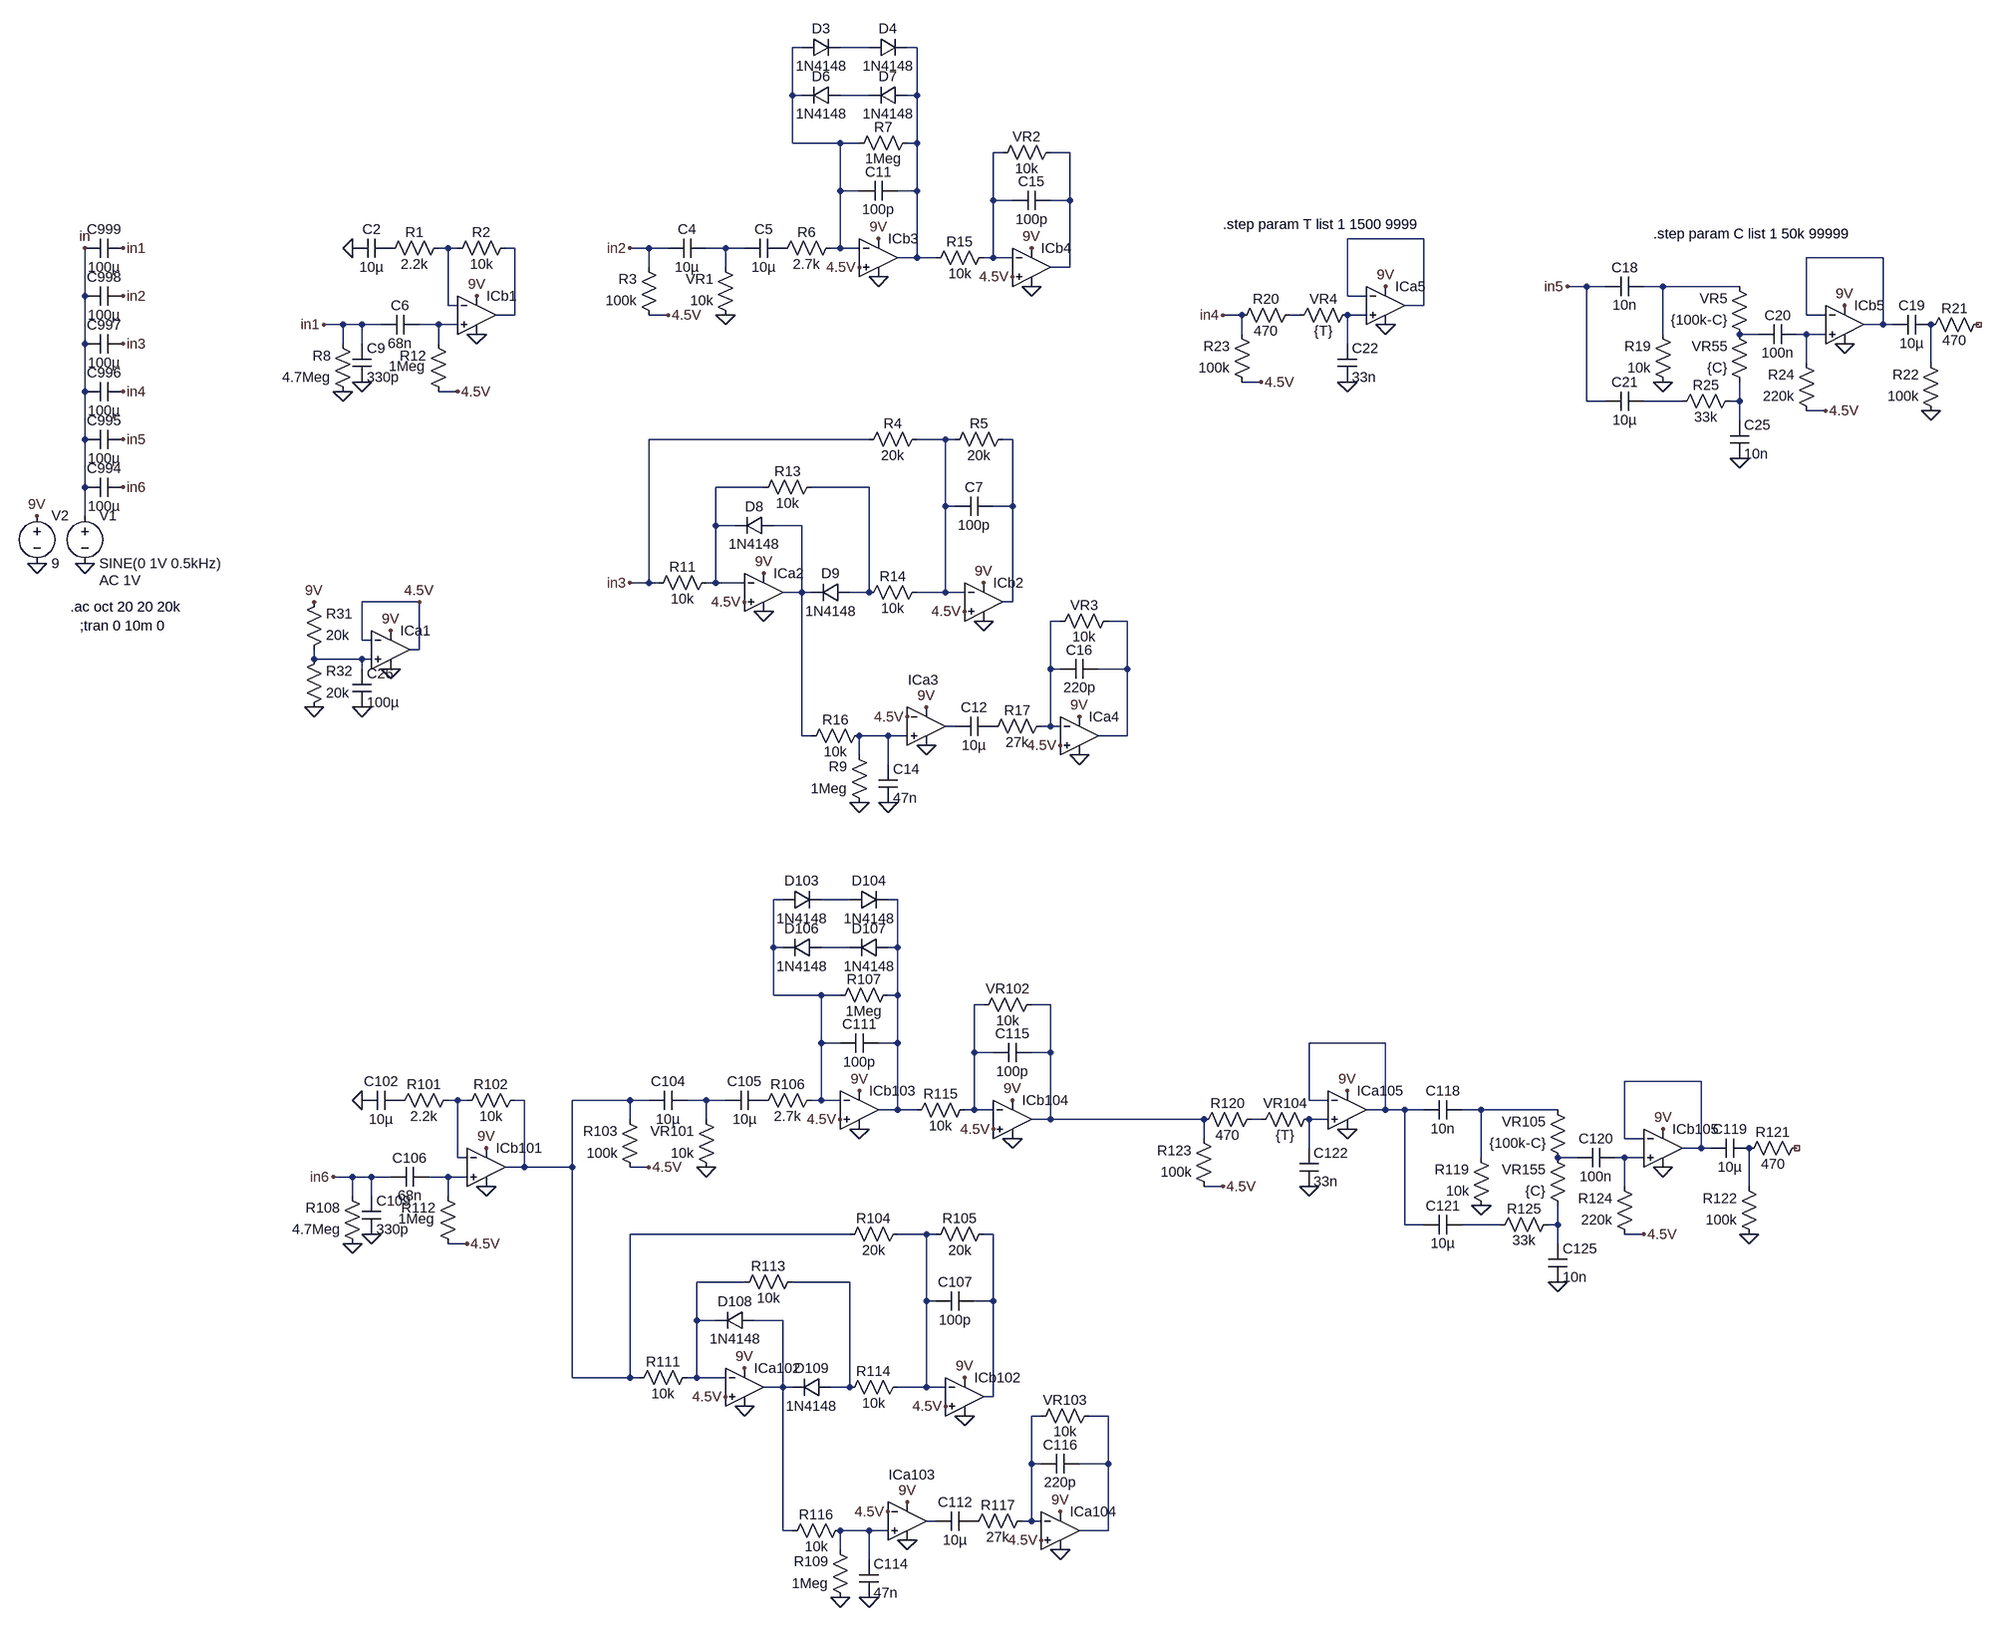
[diagram p0: schematic TheTrapperDualFuzz.asc]
TheTrapperDualFuzz.asc, the LTspice schematic file:
Version 4
SHEET 1 3148 3460
WIRE -768 400 -784 400
WIRE -656 400 -704 400
WIRE -576 400 -592 400
WIRE -784 480 -784 400
WIRE -768 480 -784 480
WIRE -656 480 -704 480
WIRE -576 480 -576 400
WIRE -576 480 -592 480
WIRE -784 560 -784 480
WIRE -704 560 -784 560
WIRE -672 560 -704 560
WIRE -576 560 -576 480
WIRE -576 560 -592 560
WIRE -432 576 -448 576
WIRE -320 576 -352 576
WIRE -704 640 -704 560
WIRE -672 640 -704 640
WIRE -576 640 -576 560
WIRE -576 640 -608 640
WIRE -448 656 -448 576
WIRE -416 656 -448 656
WIRE -320 656 -320 576
WIRE -320 656 -352 656
WIRE 272 720 144 720
WIRE -1360 736 -1376 736
WIRE -1344 736 -1360 736
WIRE -1248 736 -1264 736
WIRE -1024 736 -1056 736
WIRE -992 736 -1024 736
WIRE -896 736 -928 736
WIRE -864 736 -896 736
WIRE -704 736 -704 640
WIRE -704 736 -720 736
WIRE -672 736 -704 736
WIRE -576 752 -576 640
WIRE -576 752 -608 752
WIRE -544 752 -576 752
WIRE -448 752 -448 656
WIRE -448 752 -464 752
WIRE -416 752 -448 752
WIRE 1040 752 912 752
WIRE -1024 768 -1024 736
WIRE -896 768 -896 736
WIRE -320 768 -320 656
WIRE -320 768 -352 768
WIRE 544 800 512 800
WIRE 576 800 544 800
WIRE 672 800 640 800
WIRE 800 800 672 800
WIRE -1984 816 -1984 736
WIRE 144 816 144 720
WIRE 176 816 144 816
WIRE -1360 832 -1360 736
WIRE -1344 832 -1360 832
WIRE 272 832 272 720
WIRE 272 832 240 832
WIRE -1248 848 -1248 736
WIRE -1248 848 -1280 848
WIRE -992 848 -1024 848
WIRE -32 848 -64 848
WIRE 64 848 48 848
WIRE 176 848 144 848
WIRE 912 848 912 752
WIRE 944 848 912 848
WIRE -1536 864 -1568 864
WIRE -1504 864 -1536 864
WIRE -1472 864 -1504 864
WIRE -1376 864 -1408 864
WIRE -1344 864 -1376 864
WIRE 1040 864 1040 752
WIRE 1040 864 1008 864
WIRE 1056 864 1040 864
WIRE -32 880 -32 848
WIRE 672 880 672 800
WIRE 832 880 800 880
WIRE 912 880 896 880
WIRE 944 880 912 880
WIRE -1984 896 -1984 816
WIRE -1536 896 -1536 864
WIRE -1504 896 -1504 864
WIRE -1376 896 -1376 864
WIRE 144 896 144 848
WIRE 912 928 912 880
WIRE 1120 928 1120 864
WIRE 0 960 -32 960
WIRE -1984 976 -1984 896
WIRE -1344 976 -1376 976
WIRE 544 992 544 800
WIRE 576 992 544 992
WIRE 704 992 640 992
WIRE 800 992 800 960
WIRE 800 992 784 992
WIRE 944 1008 912 1008
WIRE 800 1024 800 992
WIRE -1984 1056 -1984 976
WIRE -656 1056 -1024 1056
WIRE -528 1056 -576 1056
WIRE -512 1056 -528 1056
WIRE -416 1056 -432 1056
WIRE -1984 1136 -1984 1056
WIRE -832 1136 -912 1136
WIRE -656 1136 -752 1136
WIRE -528 1168 -528 1056
WIRE -512 1168 -528 1168
WIRE -416 1168 -416 1056
WIRE -416 1168 -448 1168
WIRE -1984 1184 -1984 1136
WIRE -912 1200 -912 1136
WIRE -880 1200 -912 1200
WIRE -768 1200 -816 1200
WIRE -1024 1296 -1024 1056
WIRE -1024 1296 -1056 1296
WIRE -1008 1296 -1024 1296
WIRE -912 1296 -912 1200
WIRE -912 1296 -928 1296
WIRE -864 1296 -912 1296
WIRE -768 1312 -768 1200
WIRE -768 1312 -800 1312
WIRE -752 1312 -768 1312
WIRE -656 1312 -656 1136
WIRE -656 1312 -688 1312
WIRE -528 1312 -528 1168
WIRE -528 1312 -576 1312
WIRE -496 1312 -528 1312
WIRE -1408 1328 -1504 1328
WIRE -416 1328 -416 1168
WIRE -416 1328 -432 1328
WIRE -336 1360 -352 1360
WIRE -224 1360 -256 1360
WIRE -1504 1392 -1504 1328
WIRE -1488 1392 -1504 1392
WIRE -1408 1408 -1408 1328
WIRE -1408 1408 -1424 1408
WIRE -1584 1424 -1584 1408
WIRE -1504 1424 -1584 1424
WIRE -1488 1424 -1504 1424
WIRE -1504 1440 -1504 1424
WIRE -352 1440 -352 1360
WIRE -336 1440 -352 1440
WIRE -224 1440 -224 1360
WIRE -224 1440 -272 1440
WIRE -512 1536 -528 1536
WIRE -352 1536 -352 1440
WIRE -352 1536 -368 1536
WIRE -336 1536 -352 1536
WIRE -768 1552 -768 1312
WIRE -752 1552 -768 1552
WIRE -624 1552 -672 1552
WIRE -592 1552 -624 1552
WIRE -224 1552 -224 1440
WIRE -224 1552 -272 1552
WIRE -672 1584 -672 1552
WIRE -624 1600 -624 1552
WIRE -800 1936 -816 1936
WIRE -688 1936 -736 1936
WIRE -608 1936 -624 1936
WIRE -816 2016 -816 1936
WIRE -800 2016 -816 2016
WIRE -688 2016 -736 2016
WIRE -608 2016 -608 1936
WIRE -608 2016 -624 2016
WIRE -816 2096 -816 2016
WIRE -736 2096 -816 2096
WIRE -704 2096 -736 2096
WIRE -608 2096 -608 2016
WIRE -608 2096 -624 2096
WIRE -464 2112 -480 2112
WIRE -352 2112 -384 2112
WIRE -736 2176 -736 2096
WIRE -704 2176 -736 2176
WIRE -608 2176 -608 2096
WIRE -608 2176 -640 2176
WIRE 208 2176 80 2176
WIRE -480 2192 -480 2112
WIRE -448 2192 -480 2192
WIRE -352 2192 -352 2112
WIRE -352 2192 -384 2192
WIRE 736 2240 608 2240
WIRE -1344 2272 -1360 2272
WIRE -1328 2272 -1344 2272
WIRE -1232 2272 -1248 2272
WIRE -1056 2272 -1152 2272
WIRE -1024 2272 -1056 2272
WIRE -928 2272 -960 2272
WIRE -896 2272 -928 2272
WIRE -736 2272 -736 2176
WIRE -736 2272 -752 2272
WIRE -704 2272 -736 2272
WIRE 80 2272 80 2176
WIRE 112 2272 80 2272
WIRE -608 2288 -608 2176
WIRE -608 2288 -640 2288
WIRE -576 2288 -608 2288
WIRE -480 2288 -480 2192
WIRE -480 2288 -496 2288
WIRE -448 2288 -480 2288
WIRE 208 2288 208 2176
WIRE 208 2288 176 2288
WIRE 240 2288 208 2288
WIRE 272 2288 240 2288
WIRE 368 2288 336 2288
WIRE 496 2288 368 2288
WIRE -1056 2304 -1056 2272
WIRE -928 2304 -928 2272
WIRE -352 2304 -352 2192
WIRE -352 2304 -384 2304
WIRE -96 2304 -352 2304
WIRE 0 2304 -16 2304
WIRE 112 2304 80 2304
WIRE -96 2336 -96 2304
WIRE 608 2336 608 2240
WIRE 640 2336 608 2336
WIRE 80 2352 80 2304
WIRE 736 2352 736 2240
WIRE 736 2352 704 2352
WIRE 752 2352 736 2352
WIRE -1344 2368 -1344 2272
WIRE -1328 2368 -1344 2368
WIRE 368 2368 368 2288
WIRE 528 2368 496 2368
WIRE 608 2368 592 2368
WIRE 640 2368 608 2368
WIRE -1232 2384 -1232 2272
WIRE -1232 2384 -1264 2384
WIRE -1152 2384 -1152 2272
WIRE -1152 2384 -1232 2384
WIRE -1024 2384 -1056 2384
WIRE -1520 2400 -1552 2400
WIRE -1488 2400 -1520 2400
WIRE -1456 2400 -1488 2400
WIRE -1360 2400 -1392 2400
WIRE -1328 2400 -1360 2400
WIRE -64 2416 -96 2416
WIRE 608 2416 608 2368
WIRE 816 2416 816 2352
WIRE -1520 2432 -1520 2400
WIRE -1488 2432 -1488 2400
WIRE -1360 2432 -1360 2400
WIRE 240 2480 240 2288
WIRE 272 2480 240 2480
WIRE 400 2480 336 2480
WIRE 496 2480 496 2448
WIRE 496 2480 480 2480
WIRE -688 2496 -1056 2496
WIRE -560 2496 -608 2496
WIRE -544 2496 -560 2496
WIRE -448 2496 -464 2496
WIRE 640 2496 608 2496
WIRE -1328 2512 -1360 2512
WIRE 496 2512 496 2480
WIRE -864 2576 -944 2576
WIRE -688 2576 -784 2576
WIRE -560 2608 -560 2496
WIRE -544 2608 -560 2608
WIRE -448 2608 -448 2496
WIRE -448 2608 -480 2608
WIRE -944 2640 -944 2576
WIRE -912 2640 -944 2640
WIRE -800 2640 -848 2640
WIRE -1152 2736 -1152 2384
WIRE -1056 2736 -1056 2496
WIRE -1056 2736 -1152 2736
WIRE -1040 2736 -1056 2736
WIRE -944 2736 -944 2640
WIRE -944 2736 -960 2736
WIRE -896 2736 -944 2736
WIRE -800 2752 -800 2640
WIRE -800 2752 -832 2752
WIRE -784 2752 -800 2752
WIRE -688 2752 -688 2576
WIRE -688 2752 -720 2752
WIRE -560 2752 -560 2608
WIRE -560 2752 -608 2752
WIRE -528 2752 -560 2752
WIRE -448 2768 -448 2608
WIRE -448 2768 -464 2768
WIRE -368 2800 -384 2800
WIRE -256 2800 -288 2800
WIRE -384 2880 -384 2800
WIRE -368 2880 -384 2880
WIRE -256 2880 -256 2800
WIRE -256 2880 -304 2880
WIRE -544 2976 -560 2976
WIRE -384 2976 -384 2880
WIRE -384 2976 -400 2976
WIRE -368 2976 -384 2976
WIRE -800 2992 -800 2752
WIRE -784 2992 -800 2992
WIRE -656 2992 -704 2992
WIRE -624 2992 -656 2992
WIRE -256 2992 -256 2880
WIRE -256 2992 -304 2992
WIRE -704 3024 -704 2992
WIRE -656 3040 -656 2992
FLAG -1984 1264 0
FLAG -1984 736 in
FLAG -1584 1504 0
FLAG -1504 1504 0
FLAG -2064 1264 0
FLAG -2064 1184 9V
FLAG -1584 1328 9V
FLAG -832 1344 0
FLAG -832 1280 9V
FLAG -464 1360 0
FLAG -464 1296 9V
FLAG -1456 1376 9V
FLAG -1456 1440 0
FLAG -1408 1328 4.5V
FLAG -864 1328 4.5V
FLAG -496 1344 4.5V
FLAG -560 1504 9V
FLAG -560 1568 0
FLAG -592 1520 4.5V
FLAG -672 1664 0
FLAG -624 1664 0
FLAG -304 1520 9V
FLAG -304 1584 0
FLAG -336 1568 4.5V
FLAG -1536 976 0
FLAG -1504 960 0
FLAG -1312 816 9V
FLAG -1312 880 0
FLAG -1520 736 0
FLAG -1344 976 4.5V
FLAG -992 848 4.5V
FLAG -896 848 0
FLAG -640 720 9V
FLAG -640 784 0
FLAG -672 768 4.5V
FLAG -384 736 9V
FLAG -384 800 0
FLAG -416 784 4.5V
FLAG 0 960 4.5V
FLAG 208 800 9V
FLAG 208 864 0
FLAG 144 960 0
FLAG 800 1088 0
FLAG 672 960 0
FLAG 976 832 9V
FLAG 976 896 0
FLAG 944 1008 4.5V
FLAG 1120 1008 0
FLAG -1920 736 in1
FLAG -1920 816 in2
FLAG -1920 896 in3
FLAG -1920 976 in4
FLAG -1920 1056 in5
FLAG -1920 1136 in6
FLAG -1568 864 in1
FLAG -1056 736 in2
FLAG -1056 1296 in3
FLAG -64 848 in4
FLAG 512 800 in5
FLAG -864 2784 0
FLAG -864 2720 9V
FLAG -496 2800 0
FLAG -496 2736 9V
FLAG -896 2768 4.5V
FLAG -528 2784 4.5V
FLAG -592 2944 9V
FLAG -592 3008 0
FLAG -624 2960 4.5V
FLAG -704 3104 0
FLAG -656 3104 0
FLAG -336 2960 9V
FLAG -336 3024 0
FLAG -368 3008 4.5V
FLAG -1520 2512 0
FLAG -1488 2496 0
FLAG -1296 2352 9V
FLAG -1296 2416 0
FLAG -1504 2272 0
FLAG -1328 2512 4.5V
FLAG -1024 2384 4.5V
FLAG -928 2384 0
FLAG -672 2256 9V
FLAG -672 2320 0
FLAG -704 2304 4.5V
FLAG -416 2272 9V
FLAG -416 2336 0
FLAG -448 2320 4.5V
FLAG -64 2416 4.5V
FLAG 144 2256 9V
FLAG 144 2320 0
FLAG 80 2416 0
FLAG 496 2576 0
FLAG 368 2448 0
FLAG 672 2320 9V
FLAG 672 2384 0
FLAG 640 2496 4.5V
FLAG 816 2496 0
FLAG -1552 2400 in6
SYMBOL voltage -1984 1168 R0
WINDOW 123 24 124 Left 2
WINDOW 39 0 0 Left 2
SYMATTR Value2 AC 1V
SYMATTR InstName V1
SYMATTR Value SINE(0 1V 0.5kHz)
SYMBOL res -1600 1424 M180
WINDOW 0 36 76 Left 2
WINDOW 3 36 40 Left 2
SYMATTR InstName R31
SYMATTR Value 20k
SYMBOL res -1600 1520 M180
WINDOW 0 36 76 Left 2
WINDOW 3 36 40 Left 2
SYMATTR InstName R32
SYMATTR Value 20k
SYMBOL cap -1520 1504 M180
WINDOW 0 24 56 Left 2
WINDOW 3 24 8 Left 2
SYMATTR InstName C26
SYMATTR Value 100µ
SYMBOL voltage -2064 1168 R0
WINDOW 123 0 0 Left 0
WINDOW 39 0 0 Left 0
SYMATTR InstName V2
SYMATTR Value 9
SYMBOL res -736 1120 R90
WINDOW 0 5 56 VBottom 2
WINDOW 3 27 56 VTop 2
SYMATTR InstName R13
SYMATTR Value 10k
SYMBOL diode -688 1296 R90
WINDOW 0 0 32 VBottom 2
WINDOW 3 32 32 VTop 2
SYMATTR InstName D9
SYMATTR Value 1N4148
SYMBOL diode -816 1216 M270
WINDOW 0 32 32 VTop 2
WINDOW 3 0 32 VBottom 2
SYMATTR InstName D8
SYMATTR Value 1N4148
SYMBOL res -912 1280 R90
WINDOW 0 5 56 VBottom 2
WINDOW 3 27 56 VTop 2
SYMATTR InstName R11
SYMATTR Value 10k
SYMBOL res -560 1296 R90
WINDOW 0 5 56 VBottom 2
WINDOW 3 27 56 VTop 2
SYMATTR InstName R14
SYMATTR Value 10k
SYMBOL res -560 1040 R90
WINDOW 0 5 56 VBottom 2
WINDOW 3 27 56 VTop 2
SYMATTR InstName R4
SYMATTR Value 20k
SYMBOL res -416 1040 R90
WINDOW 0 5 56 VBottom 2
WINDOW 3 27 56 VTop 2
SYMATTR InstName R5
SYMATTR Value 20k
SYMBOL Opamps\\UniversalOpamp2 -1456 1408 R0
SYMATTR InstName ICa1
SYMBOL cap -448 1152 R90
WINDOW 0 0 32 VBottom 2
WINDOW 3 32 32 VTop 2
SYMATTR InstName C7
SYMATTR Value 100p
SYMBOL Opamps\\UniversalOpamp2 -832 1312 R0
SYMATTR InstName ICa2
SYMBOL Opamps\\UniversalOpamp2 -464 1328 R0
SYMATTR InstName ICb2
SYMBOL res -656 1536 R90
WINDOW 0 5 56 VBottom 2
WINDOW 3 27 56 VTop 2
SYMATTR InstName R16
SYMATTR Value 10k
SYMBOL res -656 1680 R180
WINDOW 0 36 76 Left 2
WINDOW 3 36 40 Left 2
SYMATTR InstName R9
SYMATTR Value 1Meg
SYMBOL cap -640 1600 R0
SYMATTR InstName C14
SYMATTR Value 47n
SYMBOL Opamps\\UniversalOpamp2 -560 1536 R0
WINDOW 0 -31 -77 Left 2
SYMATTR InstName ICa3
SYMBOL cap -448 1520 R90
WINDOW 0 0 32 VBottom 2
WINDOW 3 32 32 VTop 2
SYMATTR InstName C12
SYMATTR Value 10µ
SYMBOL Opamps\\UniversalOpamp2 -304 1552 R0
SYMATTR InstName ICa4
SYMBOL res -352 1520 R90
WINDOW 0 5 56 VBottom 2
WINDOW 3 27 56 VTop 2
SYMATTR InstName R17
SYMATTR Value 27k
SYMBOL res -240 1344 R90
WINDOW 0 5 56 VBottom 2
WINDOW 3 27 56 VTop 2
SYMATTR InstName VR3
SYMATTR Value 10k
SYMBOL cap -272 1424 R90
WINDOW 0 0 32 VBottom 2
WINDOW 3 32 32 VTop 2
SYMATTR InstName C16
SYMATTR Value 220p
SYMBOL res -1520 992 R180
WINDOW 0 36 76 Left 2
WINDOW 3 36 40 Left 2
SYMATTR InstName R8
SYMATTR Value 4.7Meg
SYMBOL cap -1520 896 R0
SYMATTR InstName C9
SYMATTR Value 330p
SYMBOL cap -1408 848 R90
WINDOW 0 0 32 VBottom 2
WINDOW 3 32 32 VTop 2
SYMATTR InstName C6
SYMATTR Value 68n
SYMBOL res -1360 992 R180
WINDOW 0 36 76 Left 2
WINDOW 3 38 58 Left 2
SYMATTR InstName R12
SYMATTR Value 1Meg
SYMBOL Opamps\\UniversalOpamp2 -1312 848 R0
SYMATTR InstName ICb1
SYMBOL res -1248 720 R90
WINDOW 0 5 56 VBottom 2
WINDOW 3 27 56 VTop 2
SYMATTR InstName R2
SYMATTR Value 10k
SYMBOL res -1360 720 R90
WINDOW 0 5 56 VBottom 2
WINDOW 3 27 56 VTop 2
SYMATTR InstName R1
SYMATTR Value 2.2k
SYMBOL cap -1456 720 R90
WINDOW 0 0 32 VBottom 2
WINDOW 3 32 32 VTop 2
SYMATTR InstName C2
SYMATTR Value 10µ
SYMBOL res -1008 864 R180
WINDOW 0 36 76 Left 2
WINDOW 3 36 40 Left 2
SYMATTR InstName R3
SYMATTR Value 100k
SYMBOL cap -928 720 R90
WINDOW 0 0 32 VBottom 2
WINDOW 3 32 32 VTop 2
SYMATTR InstName C4
SYMATTR Value 10µ
SYMBOL res -880 864 R180
WINDOW 0 36 76 Left 2
WINDOW 3 36 40 Left 2
SYMATTR InstName VR1
SYMATTR Value 10k
SYMBOL cap -800 720 R90
WINDOW 0 0 32 VBottom 2
WINDOW 3 32 32 VTop 2
SYMATTR InstName C5
SYMATTR Value 10µ
SYMBOL res -704 720 R90
WINDOW 0 5 56 VBottom 2
WINDOW 3 27 56 VTop 2
SYMATTR InstName R6
SYMATTR Value 2.7k
SYMBOL Opamps\\UniversalOpamp2 -640 752 R0
SYMATTR InstName ICb3
SYMBOL cap -608 624 R90
WINDOW 0 0 32 VBottom 2
WINDOW 3 32 32 VTop 2
SYMATTR InstName C11
SYMATTR Value 100p
SYMBOL res -576 544 R90
WINDOW 0 5 56 VBottom 2
WINDOW 3 27 56 VTop 2
SYMATTR InstName R7
SYMATTR Value 1Meg
SYMBOL diode -704 496 M270
WINDOW 0 32 32 VTop 2
WINDOW 3 0 32 VBottom 2
SYMATTR InstName D6
SYMATTR Value 1N4148
SYMBOL diode -592 496 M270
WINDOW 0 32 32 VTop 2
WINDOW 3 0 32 VBottom 2
SYMATTR InstName D7
SYMATTR Value 1N4148
SYMBOL diode -768 416 R270
WINDOW 0 32 32 VTop 2
WINDOW 3 0 32 VBottom 2
SYMATTR InstName D3
SYMATTR Value 1N4148
SYMBOL diode -656 416 R270
WINDOW 0 32 32 VTop 2
WINDOW 3 0 32 VBottom 2
SYMATTR InstName D4
SYMATTR Value 1N4148
SYMBOL res -448 736 R90
WINDOW 0 5 56 VBottom 2
WINDOW 3 27 56 VTop 2
SYMATTR InstName R15
SYMATTR Value 10k
SYMBOL Opamps\\UniversalOpamp2 -384 768 R0
SYMATTR InstName ICb4
SYMBOL cap -352 640 R90
WINDOW 0 0 32 VBottom 2
WINDOW 3 32 32 VTop 2
SYMATTR InstName C15
SYMATTR Value 100p
SYMBOL res -336 560 R90
WINDOW 0 5 56 VBottom 2
WINDOW 3 27 56 VTop 2
SYMATTR InstName VR2
SYMATTR Value 10k
SYMBOL res -16 976 R180
WINDOW 0 36 76 Left 2
WINDOW 3 36 40 Left 2
SYMATTR InstName R23
SYMATTR Value 100k
SYMBOL cap 640 784 R90
WINDOW 0 0 32 VBottom 2
WINDOW 3 32 32 VTop 2
SYMATTR InstName C18
SYMATTR Value 10n
SYMBOL Opamps\\UniversalOpamp2 208 832 R0
SYMATTR InstName ICa5
SYMBOL res 160 832 R90
WINDOW 0 5 56 VBottom 2
WINDOW 3 27 56 VTop 2
SYMATTR InstName VR4
SYMATTR Value {T}
SYMBOL cap 128 896 R0
SYMATTR InstName C22
SYMATTR Value 33n
SYMBOL res 688 976 R180
WINDOW 0 36 76 Left 2
WINDOW 3 36 40 Left 2
SYMATTR InstName R19
SYMATTR Value 10k
SYMBOL cap 640 976 R90
WINDOW 0 0 32 VBottom 2
WINDOW 3 32 32 VTop 2
SYMATTR InstName C21
SYMATTR Value 10µ
SYMBOL res 800 976 R90
WINDOW 0 5 56 VBottom 2
WINDOW 3 27 56 VTop 2
SYMATTR InstName R25
SYMATTR Value 33k
SYMBOL cap 784 1024 R0
SYMATTR InstName C25
SYMATTR Value 10n
SYMBOL res 816 976 R180
WINDOW 0 36 76 Left 2
WINDOW 3 36 40 Left 2
SYMATTR InstName VR55
SYMATTR Value {C}
SYMBOL res 816 896 R180
WINDOW 0 36 76 Left 2
WINDOW 3 36 40 Left 2
SYMATTR InstName VR5
SYMATTR Value {100k-C}
SYMBOL Opamps\\UniversalOpamp2 976 864 R0
SYMATTR InstName ICb5
SYMBOL cap 896 864 R90
WINDOW 0 0 32 VBottom 2
WINDOW 3 32 32 VTop 2
SYMATTR InstName C20
SYMATTR Value 100n
SYMBOL res 928 1024 R180
WINDOW 0 36 76 Left 2
WINDOW 3 36 40 Left 2
SYMATTR InstName R24
SYMATTR Value 220k
SYMBOL cap 1120 848 R90
WINDOW 0 0 32 VBottom 2
WINDOW 3 32 32 VTop 2
SYMATTR InstName C19
SYMATTR Value 10µ
SYMBOL res 1136 1024 R180
WINDOW 0 36 76 Left 2
WINDOW 3 36 40 Left 2
SYMATTR InstName R22
SYMATTR Value 100k
SYMBOL res 1216 848 R90
WINDOW 0 5 56 VBottom 2
WINDOW 3 27 56 VTop 2
SYMATTR InstName R21
SYMATTR Value 470
SYMBOL cap -1920 800 R90
WINDOW 0 0 32 VBottom 2
WINDOW 3 32 32 VTop 2
SYMATTR InstName C998
SYMATTR Value 100µ
SYMBOL cap -1920 880 R90
WINDOW 0 0 32 VBottom 2
WINDOW 3 32 32 VTop 2
SYMATTR InstName C997
SYMATTR Value 100µ
SYMBOL cap -1920 960 R90
WINDOW 0 0 32 VBottom 2
WINDOW 3 32 32 VTop 2
SYMATTR InstName C996
SYMATTR Value 100µ
SYMBOL cap -1920 720 R90
WINDOW 0 0 32 VBottom 2
WINDOW 3 32 32 VTop 2
SYMATTR InstName C999
SYMATTR Value 100µ
SYMBOL cap -1920 1040 R90
WINDOW 0 0 32 VBottom 2
WINDOW 3 32 32 VTop 2
SYMATTR InstName C995
SYMATTR Value 100µ
SYMBOL cap -1920 1120 R90
WINDOW 0 0 32 VBottom 2
WINDOW 3 32 32 VTop 2
SYMATTR InstName C994
SYMATTR Value 100µ
SYMBOL res 64 832 R90
WINDOW 0 5 56 VBottom 2
WINDOW 3 27 56 VTop 2
SYMATTR InstName R20
SYMATTR Value 470
SYMBOL res -768 2560 R90
WINDOW 0 5 56 VBottom 2
WINDOW 3 27 56 VTop 2
SYMATTR InstName R113
SYMATTR Value 10k
SYMBOL diode -720 2736 R90
WINDOW 0 0 32 VBottom 2
WINDOW 3 32 32 VTop 2
SYMATTR InstName D109
SYMATTR Value 1N4148
SYMBOL diode -848 2656 M270
WINDOW 0 32 32 VTop 2
WINDOW 3 0 32 VBottom 2
SYMATTR InstName D108
SYMATTR Value 1N4148
SYMBOL res -944 2720 R90
WINDOW 0 5 56 VBottom 2
WINDOW 3 27 56 VTop 2
SYMATTR InstName R111
SYMATTR Value 10k
SYMBOL res -592 2736 R90
WINDOW 0 5 56 VBottom 2
WINDOW 3 27 56 VTop 2
SYMATTR InstName R114
SYMATTR Value 10k
SYMBOL res -592 2480 R90
WINDOW 0 5 56 VBottom 2
WINDOW 3 27 56 VTop 2
SYMATTR InstName R104
SYMATTR Value 20k
SYMBOL res -448 2480 R90
WINDOW 0 5 56 VBottom 2
WINDOW 3 27 56 VTop 2
SYMATTR InstName R105
SYMATTR Value 20k
SYMBOL cap -480 2592 R90
WINDOW 0 0 32 VBottom 2
WINDOW 3 32 32 VTop 2
SYMATTR InstName C107
SYMATTR Value 100p
SYMBOL Opamps\\UniversalOpamp2 -864 2752 R0
SYMATTR InstName ICa102
SYMBOL Opamps\\UniversalOpamp2 -496 2768 R0
SYMATTR InstName ICb102
SYMBOL res -688 2976 R90
WINDOW 0 5 56 VBottom 2
WINDOW 3 27 56 VTop 2
SYMATTR InstName R116
SYMATTR Value 10k
SYMBOL res -688 3120 R180
WINDOW 0 36 76 Left 2
WINDOW 3 36 40 Left 2
SYMATTR InstName R109
SYMATTR Value 1Meg
SYMBOL cap -672 3040 R0
SYMATTR InstName C114
SYMATTR Value 47n
SYMBOL Opamps\\UniversalOpamp2 -592 2976 R0
WINDOW 0 -31 -77 Left 2
SYMATTR InstName ICa103
SYMBOL cap -480 2960 R90
WINDOW 0 0 32 VBottom 2
WINDOW 3 32 32 VTop 2
SYMATTR InstName C112
SYMATTR Value 10µ
SYMBOL Opamps\\UniversalOpamp2 -336 2992 R0
SYMATTR InstName ICa104
SYMBOL res -384 2960 R90
WINDOW 0 5 56 VBottom 2
WINDOW 3 27 56 VTop 2
SYMATTR InstName R117
SYMATTR Value 27k
SYMBOL res -272 2784 R90
WINDOW 0 5 56 VBottom 2
WINDOW 3 27 56 VTop 2
SYMATTR InstName VR103
SYMATTR Value 10k
SYMBOL cap -304 2864 R90
WINDOW 0 0 32 VBottom 2
WINDOW 3 32 32 VTop 2
SYMATTR InstName C116
SYMATTR Value 220p
SYMBOL res -1504 2528 R180
WINDOW 0 36 76 Left 2
WINDOW 3 36 40 Left 2
SYMATTR InstName R108
SYMATTR Value 4.7Meg
SYMBOL cap -1504 2432 R0
SYMATTR InstName C109
SYMATTR Value 330p
SYMBOL cap -1392 2384 R90
WINDOW 0 0 32 VBottom 2
WINDOW 3 32 32 VTop 2
SYMATTR InstName C106
SYMATTR Value 68n
SYMBOL res -1344 2528 R180
WINDOW 0 36 76 Left 2
WINDOW 3 38 58 Left 2
SYMATTR InstName R112
SYMATTR Value 1Meg
SYMBOL Opamps\\UniversalOpamp2 -1296 2384 R0
SYMATTR InstName ICb101
SYMBOL res -1232 2256 R90
WINDOW 0 5 56 VBottom 2
WINDOW 3 27 56 VTop 2
SYMATTR InstName R102
SYMATTR Value 10k
SYMBOL res -1344 2256 R90
WINDOW 0 5 56 VBottom 2
WINDOW 3 27 56 VTop 2
SYMATTR InstName R101
SYMATTR Value 2.2k
SYMBOL cap -1440 2256 R90
WINDOW 0 0 32 VBottom 2
WINDOW 3 32 32 VTop 2
SYMATTR InstName C102
SYMATTR Value 10µ
SYMBOL res -1040 2400 R180
WINDOW 0 36 76 Left 2
WINDOW 3 36 40 Left 2
SYMATTR InstName R103
SYMATTR Value 100k
SYMBOL cap -960 2256 R90
WINDOW 0 0 32 VBottom 2
WINDOW 3 32 32 VTop 2
SYMATTR InstName C104
SYMATTR Value 10µ
SYMBOL res -912 2400 R180
WINDOW 0 36 76 Left 2
WINDOW 3 36 40 Left 2
SYMATTR InstName VR101
SYMATTR Value 10k
SYMBOL cap -832 2256 R90
WINDOW 0 0 32 VBottom 2
WINDOW 3 32 32 VTop 2
SYMATTR InstName C105
SYMATTR Value 10µ
SYMBOL res -736 2256 R90
WINDOW 0 5 56 VBottom 2
WINDOW 3 27 56 VTop 2
SYMATTR InstName R106
SYMATTR Value 2.7k
SYMBOL Opamps\\UniversalOpamp2 -672 2288 R0
SYMATTR InstName ICb103
SYMBOL cap -640 2160 R90
WINDOW 0 0 32 VBottom 2
WINDOW 3 32 32 VTop 2
SYMATTR InstName C111
SYMATTR Value 100p
SYMBOL res -608 2080 R90
WINDOW 0 5 56 VBottom 2
WINDOW 3 27 56 VTop 2
SYMATTR InstName R107
SYMATTR Value 1Meg
SYMBOL diode -736 2032 M270
WINDOW 0 32 32 VTop 2
WINDOW 3 0 32 VBottom 2
SYMATTR InstName D106
SYMATTR Value 1N4148
SYMBOL diode -624 2032 M270
WINDOW 0 32 32 VTop 2
WINDOW 3 0 32 VBottom 2
SYMATTR InstName D107
SYMATTR Value 1N4148
SYMBOL diode -800 1952 R270
WINDOW 0 32 32 VTop 2
WINDOW 3 0 32 VBottom 2
SYMATTR InstName D103
SYMATTR Value 1N4148
SYMBOL diode -688 1952 R270
WINDOW 0 32 32 VTop 2
WINDOW 3 0 32 VBottom 2
SYMATTR InstName D104
SYMATTR Value 1N4148
SYMBOL res -480 2272 R90
WINDOW 0 5 56 VBottom 2
WINDOW 3 27 56 VTop 2
SYMATTR InstName R115
SYMATTR Value 10k
SYMBOL Opamps\\UniversalOpamp2 -416 2304 R0
SYMATTR InstName ICb104
SYMBOL cap -384 2176 R90
WINDOW 0 0 32 VBottom 2
WINDOW 3 32 32 VTop 2
SYMATTR InstName C115
SYMATTR Value 100p
SYMBOL res -368 2096 R90
WINDOW 0 5 56 VBottom 2
WINDOW 3 27 56 VTop 2
SYMATTR InstName VR102
SYMATTR Value 10k
SYMBOL res -80 2432 R180
WINDOW 0 36 76 Left 2
WINDOW 3 36 40 Left 2
SYMATTR InstName R123
SYMATTR Value 100k
SYMBOL cap 336 2272 R90
WINDOW 0 0 32 VBottom 2
WINDOW 3 32 32 VTop 2
SYMATTR InstName C118
SYMATTR Value 10n
SYMBOL Opamps\\UniversalOpamp2 144 2288 R0
SYMATTR InstName ICa105
SYMBOL res 96 2288 R90
WINDOW 0 5 56 VBottom 2
WINDOW 3 27 56 VTop 2
SYMATTR InstName VR104
SYMATTR Value {T}
SYMBOL cap 64 2352 R0
SYMATTR InstName C122
SYMATTR Value 33n
SYMBOL res 384 2464 R180
WINDOW 0 36 76 Left 2
WINDOW 3 36 40 Left 2
SYMATTR InstName R119
SYMATTR Value 10k
SYMBOL cap 336 2464 R90
WINDOW 0 0 32 VBottom 2
WINDOW 3 32 32 VTop 2
SYMATTR InstName C121
SYMATTR Value 10µ
SYMBOL res 496 2464 R90
WINDOW 0 5 56 VBottom 2
WINDOW 3 27 56 VTop 2
SYMATTR InstName R125
SYMATTR Value 33k
SYMBOL cap 480 2512 R0
SYMATTR InstName C125
SYMATTR Value 10n
SYMBOL res 512 2464 R180
WINDOW 0 36 76 Left 2
WINDOW 3 36 40 Left 2
SYMATTR InstName VR155
SYMATTR Value {C}
SYMBOL res 512 2384 R180
WINDOW 0 36 76 Left 2
WINDOW 3 36 40 Left 2
SYMATTR InstName VR105
SYMATTR Value {100k-C}
SYMBOL Opamps\\UniversalOpamp2 672 2352 R0
SYMATTR InstName ICb105
SYMBOL cap 592 2352 R90
WINDOW 0 0 32 VBottom 2
WINDOW 3 32 32 VTop 2
SYMATTR InstName C120
SYMATTR Value 100n
SYMBOL res 624 2512 R180
WINDOW 0 36 76 Left 2
WINDOW 3 36 40 Left 2
SYMATTR InstName R124
SYMATTR Value 220k
SYMBOL cap 816 2336 R90
WINDOW 0 0 32 VBottom 2
WINDOW 3 32 32 VTop 2
SYMATTR InstName C119
SYMATTR Value 10µ
SYMBOL res 832 2512 R180
WINDOW 0 36 76 Left 2
WINDOW 3 36 40 Left 2
SYMATTR InstName R122
SYMATTR Value 100k
SYMBOL res 912 2336 R90
WINDOW 0 5 56 VBottom 2
WINDOW 3 27 56 VTop 2
SYMATTR InstName R121
SYMATTR Value 470
SYMBOL res 0 2288 R90
WINDOW 0 5 56 VBottom 2
WINDOW 3 27 56 VTop 2
SYMATTR InstName R120
SYMATTR Value 470
TEXT -2008 1336 Left 2 !.ac oct 20 20 20k
TEXT -1992 1368 Left 2 !;tran 0 10m 0
TEXT 656 712 Left 2 !.step param C list 1 50k 99999
TEXT -64 696 Left 2 !.step param T list 1 1500 9999

The netlist it stands for:
* TheTrapperDualFuzz.asc
V1 in 0 SINE(0 1V 0.5kHz) AC 1V
R31 N028 9V 20k
R32 0 N028 20k
C26 0 N028 100µ
V2 9V 0 9
R13 N024 N023 10k
D9 N024 N025 1N4148
D8 N025 N023 1N4148
R11 N023 in3 10k
R14 N021 N024 10k
R4 N021 in3 20k
R5 N022 N021 20k
XICa1 N028 4.5V 9V 0 4.5V level.2 Avol=1Meg GBW=10Meg Slew=10Meg ilimit=25m rail=0 Vos=0 phimargin=45 en=0 enk=0 in=0 ink=0 Rin=500Meg  ; pins IN+ IN- V+ V- OUT
C7 N022 N021 100p
XICa2 4.5V N023 9V 0 N025 level.2 Avol=1Meg GBW=10Meg Slew=10Meg ilimit=25m rail=0 Vos=0 phimargin=45 en=0 enk=0 in=0 ink=0 Rin=500Meg  ; pins IN+ IN- V+ V- OUT
XICb2 4.5V N021 9V 0 N022 level.2 Avol=1Meg GBW=10Meg Slew=10Meg ilimit=25m rail=0 Vos=0 phimargin=45 en=0 enk=0 in=0 ink=0 Rin=500Meg  ; pins IN+ IN- V+ V- OUT
R16 N030 N025 10k
R9 0 N030 1Meg
C14 N030 0 47n
XICa3 N030 4.5V 9V 0 N029 level.2 Avol=1Meg GBW=10Meg Slew=10Meg ilimit=25m rail=0 Vos=0 phimargin=45 en=0 enk=0 in=0 ink=0 Rin=500Meg  ; pins IN+ IN- V+ V- OUT
C12 P001 N029 10µ
XICa4 4.5V N026 9V 0 N027 level.2 Avol=1Meg GBW=10Meg Slew=10Meg ilimit=25m rail=0 Vos=0 phimargin=45 en=0 enk=0 in=0 ink=0 Rin=500Meg  ; pins IN+ IN- V+ V- OUT
R17 N026 P001 27k
R§VR3 N027 N026 10k
C16 N027 N026 220p
R8 0 in1 4.7Meg
C9 in1 0 330p
C6 N015 in1 68n
R12 4.5V N015 1Meg
XICb1 N015 N008 9V 0 N009 level.2 Avol=1Meg GBW=10Meg Slew=10Meg ilimit=25m rail=0 Vos=0 phimargin=45 en=0 enk=0 in=0 ink=0 Rin=500Meg  ; pins IN+ IN- V+ V- OUT
R2 N009 N008 10k
R1 N008 P002 2.2k
C2 P002 0 10µ
R3 4.5V in2 100k
C4 N010 in2 10µ
R§VR1 0 N010 10k
C5 P003 N010 10µ
R6 N001 P003 2.7k
XICb3 4.5V N001 9V 0 N003 level.2 Avol=1Meg GBW=10Meg Slew=10Meg ilimit=25m rail=0 Vos=0 phimargin=45 en=0 enk=0 in=0 ink=0 Rin=500Meg  ; pins IN+ IN- V+ V- OUT
C11 N003 N001 100p
R7 N003 N001 1Meg
D6 N004 N001 1N4148
D7 N003 N004 1N4148
D3 N001 N002 1N4148
D4 N002 N003 1N4148
R15 N005 N003 10k
XICb4 4.5V N005 9V 0 N006 level.2 Avol=1Meg GBW=10Meg Slew=10Meg ilimit=25m rail=0 Vos=0 phimargin=45 en=0 enk=0 in=0 ink=0 Rin=500Meg  ; pins IN+ IN- V+ V- OUT
C15 N006 N005 100p
R§VR2 N006 N005 10k
R23 4.5V in4 100k
C18 N012 in5 10n
XICa5 N014 N007 9V 0 N007 level.2 Avol=1Meg GBW=10Meg Slew=10Meg ilimit=25m rail=0 Vos=0 phimargin=45 en=0 enk=0 in=0 ink=0 Rin=500Meg  ; pins IN+ IN- V+ V- OUT
R§VR4 N014 N013 {T}
C22 N014 0 33n
R19 0 N012 10k
C21 N019 in5 10µ
R25 N020 N019 33k
C25 N020 0 10n
R§VR55 N020 N016 {C}
R§VR5 N016 N012 {100k-C}
XICb5 N017 N011 9V 0 N011 level.2 Avol=1Meg GBW=10Meg Slew=10Meg ilimit=25m rail=0 Vos=0 phimargin=45 en=0 enk=0 in=0 ink=0 Rin=500Meg  ; pins IN+ IN- V+ V- OUT
C20 N017 N016 100n
R24 4.5V N017 220k
C19 N018 N011 10µ
R22 0 N018 100k
R21 NC_01 N018 470
C998 in2 in 100µ
C997 in3 in 100µ
C996 in4 in 100µ
C999 in1 in 100µ
C995 in5 in 100µ
C994 in6 in 100µ
R20 N013 in4 470
R113 N054 N053 10k
D109 N054 N055 1N4148
D108 N055 N053 1N4148
R111 N053 N040 10k
R114 N051 N054 10k
R104 N051 N040 20k
R105 N052 N051 20k
C107 N052 N051 100p
XICa102 4.5V N053 9V 0 N055 level.2 Avol=1Meg GBW=10Meg Slew=10Meg ilimit=25m rail=0 Vos=0 phimargin=45 en=0 enk=0 in=0 ink=0 Rin=500Meg  ; pins IN+ IN- V+ V- OUT
XICb102 4.5V N051 9V 0 N052 level.2 Avol=1Meg GBW=10Meg Slew=10Meg ilimit=25m rail=0 Vos=0 phimargin=45 en=0 enk=0 in=0 ink=0 Rin=500Meg  ; pins IN+ IN- V+ V- OUT
R116 N059 N055 10k
R109 0 N059 1Meg
C114 N059 0 47n
XICa103 N059 4.5V 9V 0 N058 level.2 Avol=1Meg GBW=10Meg Slew=10Meg ilimit=25m rail=0 Vos=0 phimargin=45 en=0 enk=0 in=0 ink=0 Rin=500Meg  ; pins IN+ IN- V+ V- OUT
C112 P004 N058 10µ
XICa104 4.5V N056 9V 0 N057 level.2 Avol=1Meg GBW=10Meg Slew=10Meg ilimit=25m rail=0 Vos=0 phimargin=45 en=0 enk=0 in=0 ink=0 Rin=500Meg  ; pins IN+ IN- V+ V- OUT
R117 N056 P004 27k
R§VR103 N057 N056 10k
C116 N057 N056 220p
R108 0 in6 4.7Meg
C109 in6 0 330p
C106 N047 in6 68n
R112 4.5V N047 1Meg
XICb101 N047 N039 9V 0 N040 level.2 Avol=1Meg GBW=10Meg Slew=10Meg ilimit=25m rail=0 Vos=0 phimargin=45 en=0 enk=0 in=0 ink=0 Rin=500Meg  ; pins IN+ IN- V+ V- OUT
R102 N040 N039 10k
R101 N039 P005 2.2k
C102 P005 0 10µ
R103 4.5V N040 100k
C104 N041 N040 10µ
R§VR101 0 N041 10k
C105 P006 N041 10µ
R106 N031 P006 2.7k
XICb103 4.5V N031 9V 0 N033 level.2 Avol=1Meg GBW=10Meg Slew=10Meg ilimit=25m rail=0 Vos=0 phimargin=45 en=0 enk=0 in=0 ink=0 Rin=500Meg  ; pins IN+ IN- V+ V- OUT
C111 N033 N031 100p
R107 N033 N031 1Meg
D106 N034 N031 1N4148
D107 N033 N034 1N4148
D103 N031 N032 1N4148
D104 N032 N033 1N4148
R115 N035 N033 10k
XICb104 4.5V N035 9V 0 N036 level.2 Avol=1Meg GBW=10Meg Slew=10Meg ilimit=25m rail=0 Vos=0 phimargin=45 en=0 enk=0 in=0 ink=0 Rin=500Meg  ; pins IN+ IN- V+ V- OUT
C115 N036 N035 100p
R§VR102 N036 N035 10k
R123 4.5V N036 100k
C118 N042 N037 10n
XICa105 N044 N037 9V 0 N037 level.2 Avol=1Meg GBW=10Meg Slew=10Meg ilimit=25m rail=0 Vos=0 phimargin=45 en=0 enk=0 in=0 ink=0 Rin=500Meg  ; pins IN+ IN- V+ V- OUT
R§VR104 N044 N043 {T}
C122 N044 0 33n
R119 0 N042 10k
C121 N049 N037 10µ
R125 N050 N049 33k
C125 N050 0 10n
R§VR155 N050 N045 {C}
R§VR105 N045 N042 {100k-C}
XICb105 N046 N038 9V 0 N038 level.2 Avol=1Meg GBW=10Meg Slew=10Meg ilimit=25m rail=0 Vos=0 phimargin=45 en=0 enk=0 in=0 ink=0 Rin=500Meg  ; pins IN+ IN- V+ V- OUT
C120 N046 N045 100n
R124 4.5V N046 220k
C119 N048 N038 10µ
R122 0 N048 100k
R121 NC_02 N048 470
R120 N043 N036 470
.model D D
.lib standard.dio
.ac oct 20 20 20k
;tran 0 10m 0
.step param C list 1 50k 99999
.step param T list 1 1500 9999
.lib UniversalOpamps2.sub
.backanno
.end